# Altium schematic sheet Ada - Base Block - Microcontroller Issue 4.0.SchDoc: Title
size A3; DrawnBy: Name; DocumentNumber: 3; Revision: A; SheetNumber: 3; SheetTotal: 4
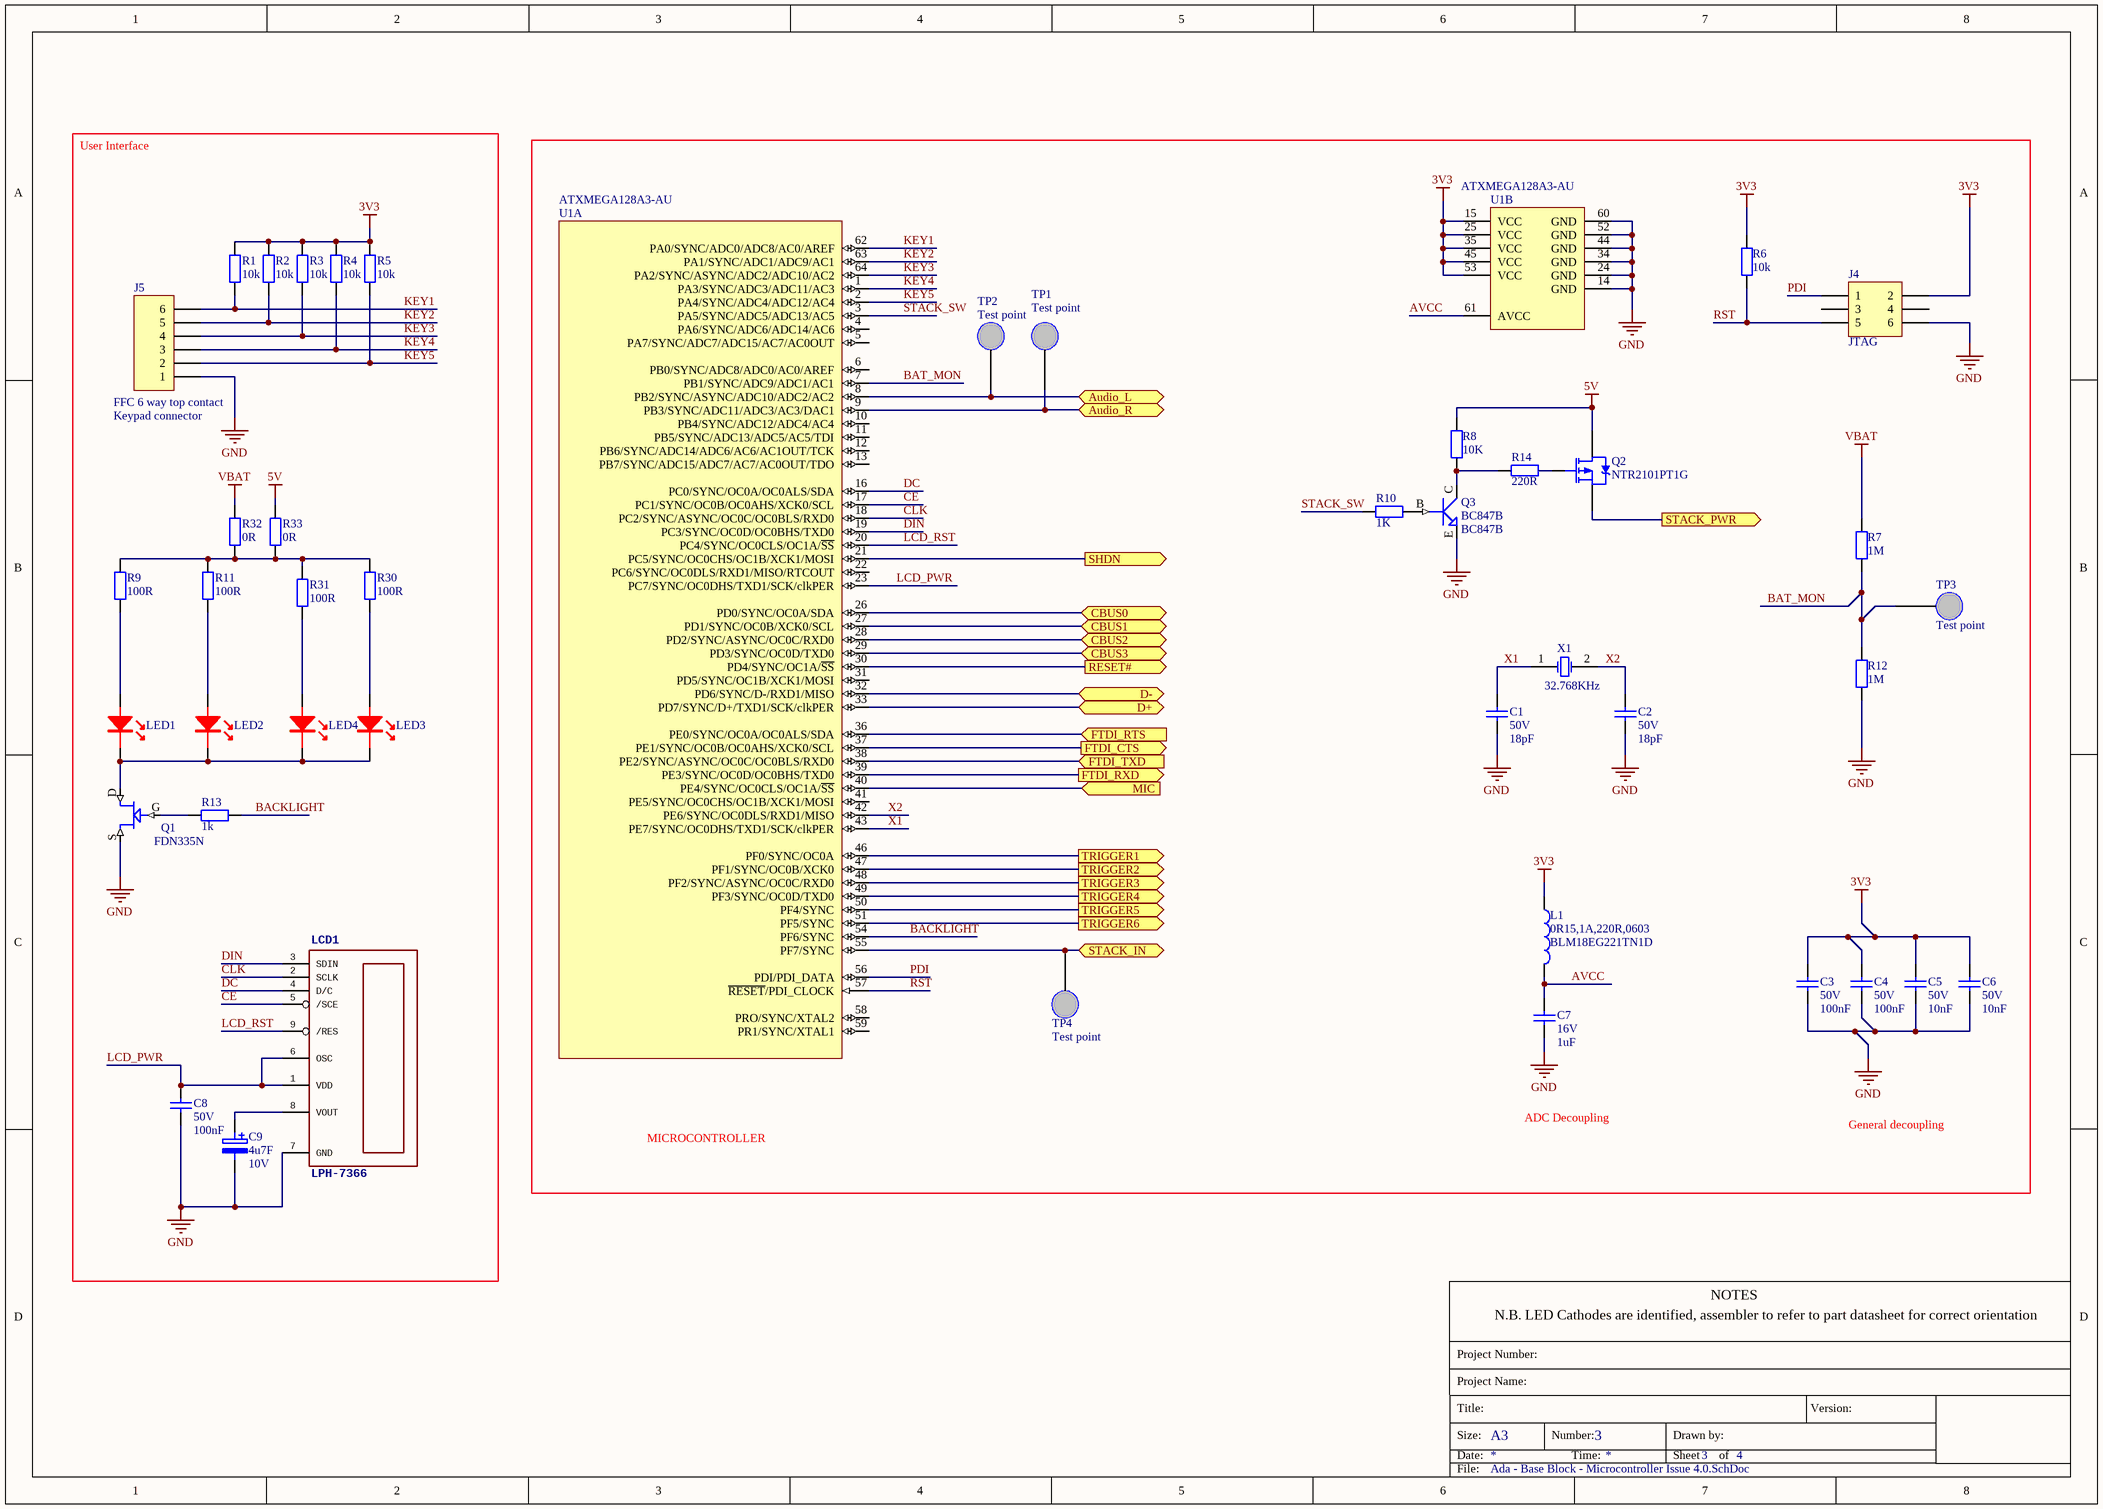
[diagram p0: Ada - Base Block - Microcontroller Issue 4.0.SchDoc]

## Parts
C1  Voltage: 50V  [C0603]  (hidden comment: 18pF)
C2  Voltage: 50V  [C0603]  (hidden comment: 18pF)
C3  value 100nF  Voltage: 50V  [C0603]  (hidden comment: 100nF, 16V, 0603)
C4  value 100nF  Voltage: 50V  [C0603]  (hidden comment: 100nF, 16V, 0603)
C5  Voltage: 50V  [C0603]  (hidden comment: 10nF)
C6  Voltage: 50V  [C0603]  (hidden comment: 10nF)
C7  value 1uF  Voltage: 16V  [C0603]  (hidden comment: 1uF, 16V, 0603)
C8  value 100nF  Voltage: 50V  [C0603]  (hidden comment: 100nF, 16V, 0603)
C9  value 4u7F  Voltage: 10V  [KEMET CASE A]  (hidden comment: 4U7F, 10V, case_a)
J4  JTAG  [HDR2X3]
J5  Keypad connector  value FFC 6 way top contact  [HLW6R-2C7LF]
L1  0R15,1A,220R,0603  value BLM18EG221TN1D  [L0603]
LCD1  LPH-7366  [LPH-7366]
LED1  LED RED 0805 SUPER-RED  [LED, RED, 0805]  (value not drawn)
LED2  LED RED 0805 SUPER-RED  [LED, RED, 0805]  (value not drawn)
LED3  LED RED 0805 SUPER-RED  [LED, RED, 0805]  (value not drawn)
LED4  LED RED 0805 SUPER-RED  [LED, RED, 0805]  (value not drawn)
Q1  FDN335N  [SOT-23]
Q2  NTR2101PT1G  [SOT-23 DIODE - duplicate]
Q3  BC847B  [SOT-23T]
R1  value 10k  [R0603]  (hidden comment: Resistor 0603)
R2  value 10k  [R0603]  (hidden comment: Resistor 0603)
R3  value 10k  [R0603]  (hidden comment: Resistor 0603)
R4  value 10k  [R0603]  (hidden comment: Resistor 0603)
R5  value 10k  [R0603]  (hidden comment: Resistor 0603)
R6  value 10k  [R0603]  (hidden comment: Resistor 0603)
R7  value 1M  [R0603]  (hidden comment: Resistor 0603)
R8  value 10K  [R0603]  (hidden comment: Resistor 0603)
R9  value 100R  [R0603]  (hidden comment: Resistor 0603)
R10  value 1K  [R0603]  (hidden comment: Resistor 0603)
R11  value 100R  [R0603]  (hidden comment: Resistor 0603)
R12  value 1M  [R0603]  (hidden comment: Resistor 0603)
R13  value 1k  [R0603]  (hidden comment: Resistor 0603)
R14  value 220R  [R0603]  (hidden comment: Resistor 0603)
R30  value 100R  [R0603]  (hidden comment: Resistor 0603)
R31  value 100R  [R0603]  (hidden comment: Resistor 0603)
R32  value 0R  [R0603]  (hidden comment: Resistor 0603)
R33  0R  [R0603]
TP1  Test point  [TP]  (no BOM)
TP2  Test point  [TP]  (no BOM)
TP3  Test point  [TP]  (no BOM)
TP4  Test point  [TP]  (no BOM)
U1  ATXMEGA128A3-AU  [64A_N]  (parts A,B of 2)
X1  value 32.768KHz  [FC 13F]  (hidden comment: XTAL 32.768KHZ)

## Blocks framed on the sheet
User Interface: C8 C9 J5 LCD1 LED1-LED4 Q1 R1-R5 R9 R11 R13 R30-R33

## Ports
Audio_L (bidir), Audio_R (bidir), CBUS0 (bidir), CBUS1 (bidir), CBUS2 (bidir), CBUS3 (bidir), D+ (bidir), D- (bidir), FTDI_CTS (out), FTDI_RTS (in), FTDI_RXD (out), FTDI_TXD (in), MIC (in), RESET# (out), SHDN (out), STACK_IN (bidir), STACK_PWR (out), TRIGGER1 (out), TRIGGER2 (out), TRIGGER3 (out), TRIGGER4 (out), TRIGGER5 (out), TRIGGER6 (out)

## Nets
3V3: C3.2 C4.2 C5.2 C6.2 J4.2 L1.1 R1.2 R2.2 R3.2 R4.2 R5.2 R6.2 U1.15(VCC) U1.25(VCC) U1.35(VCC) U1.45(VCC) U1.53(VCC)
5V: Q2.2(S) R8.1 R33.2
GND: C1.1 C2.1 C3.1 C4.1 C5.1 C6.1 C7.1 C8.1 C9.2 J4.6 J5.1 LCD1.7(GND) Q1.S Q3.E(EMITTER) R12.1 U1.14(GND) U1.24(GND) U1.34(GND) U1.44(GND) U1.52(GND) U1.60(GND)
VBAT: R7.2 R32.2
Audio_L: TP2.1 U1.8(PB2/SYNC/ASYNC/ADC10/ADC2/AC2) ; port Audio_L
Audio_R: TP1.1 U1.9(PB3/SYNC/ADC11/ADC3/AC3/DAC1) ; port Audio_R
AVCC: C7.2 L1.2 U1.61(AVCC)
BACKLIGHT: R13.1 U1.54(PF6/SYNC)
BAT_MON: R7.1 R12.2 TP3.1 U1.7(PB1/SYNC/ADC9/ADC1/AC1)
CBUS0: U1.26(PD0/SYNC/OC0A/SDA) ; port CBUS0
CBUS1: U1.27(PD1/SYNC/OC0B/XCK0/SCL) ; port CBUS1
CBUS2: U1.28(PD2/SYNC/ASYNC/OC0C/RXD0) ; port CBUS2
CBUS3: U1.29(PD3/SYNC/OC0D/TXD0) ; port CBUS3
CE: LCD1.5(/SCE) U1.17(PC1/SYNC/OC0B/OC0AHS/XCK0/SCL)
CLK: LCD1.2(SCLK) U1.18(PC2/SYNC/ASYNC/OC0C/OC0BLS/RXD0)
D+: U1.33(PD7/SYNC/D+/TXD1/SCK/clkPER) ; port D+
D-: U1.32(PD6/SYNC/D-/RXD1/MISO) ; port D-
DC: LCD1.4(D/C) U1.16(PC0/SYNC/OC0A/OC0ALS/SDA)
DIN: LCD1.3(SDIN) U1.19(PC3/SYNC/OC0D/OC0BHS/TXD0)
FTDI_CTS: U1.37(PE1/SYNC/OC0B/OC0AHS/XCK0/SCL) ; port FTDI_CTS
FTDI_RTS: U1.36(PE0/SYNC/OC0A/OC0ALS/SDA) ; port FTDI_RTS
FTDI_RXD: U1.39(PE3/SYNC/OC0D/OC0BHS/TXD0) ; port FTDI_RXD
FTDI_TXD: U1.38(PE2/SYNC/ASYNC/OC0C/OC0BLS/RXD0) ; port FTDI_TXD
KEY1: J5.6 R1.1 U1.62(PA0/SYNC/ADC0/ADC8/AC0/AREF)
KEY2: J5.5 R2.1 U1.63(PA1/SYNC/ADC1/ADC9/AC1)
KEY3: J5.4 R3.1 U1.64(PA2/SYNC/ASYNC/ADC2/ADC10/AC2)
KEY4: J5.3 R4.1 U1.1(PA3/SYNC/ADC3/ADC11/AC3)
KEY5: J5.2 R5.1 U1.2(PA4/SYNC/ADC4/ADC12/AC4)
LCD_PWR: C8.2 LCD1.1(VDD) LCD1.6(OSC) U1.23(PC7/SYNC/OC0DHS/TXD1/SCK/clkPER)
LCD_RST: LCD1.9(/RES) U1.20(PC4/SYNC/OC0CLS/OC1A/~{SS})
MIC: U1.40(PE4/SYNC/OC0CLS/OC1A/~{SS}) ; port MIC
PDI: J4.1 U1.56(PDI/PDI_DATA)
RESET#: U1.30(PD4/SYNC/OC1A/~{SS}) ; port RESET#
RST: J4.5 R6.1 U1.57(~{RESET}/PDI_CLOCK)
SHDN: U1.21(PC5/SYNC/OC0CHS/OC1B/XCK1/MOSI) ; port SHDN
STACK_IN: TP4.1 U1.55(PF7/SYNC) ; port STACK_IN
STACK_PWR: Q2.3(D) ; port STACK_PWR
STACK_SW: R10.1 U1.3(PA5/SYNC/ADC5/ADC13/AC5)
TRIGGER1: U1.46(PF0/SYNC/OC0A) ; port TRIGGER1
TRIGGER2: U1.47(PF1/SYNC/OC0B/XCK0) ; port TRIGGER2
TRIGGER3: U1.48(PF2/SYNC/ASYNC/OC0C/RXD0) ; port TRIGGER3
TRIGGER4: U1.49(PF3/SYNC/OC0D/TXD0) ; port TRIGGER4
TRIGGER5: U1.50(PF4/SYNC) ; port TRIGGER5
TRIGGER6: U1.51(PF5/SYNC) ; port TRIGGER6
X1: C1.2 U1.43(PE7/SYNC/OC0DHS/TXD1/SCK/clkPER) X1.1(OSC1)
X2: C2.2 U1.42(PE6/SYNC/OC0DLS/RXD1/MISO) X1.2(OSC2)
NetC9_1: C9.1 LCD1.8(VOUT)
NetLED1_A: LED1.A R9.1
NetLED1_K: LED1.K LED2.K LED3.K LED4.K Q1.D
NetLED2_A: LED2.A R11.1
NetLED3_A: LED3.A R30.1
NetLED4_A: LED4.A R31.1
NetQ1_G: Q1.G R13.2
NetQ2_1: Q2.1(G) R14.2
NetQ3_B: Q3.B(BASE) R10.2
NetQ3_C: Q3.C(COLLECTOR) R8.2 R14.1
NetR9_2: R9.2 R11.2 R30.2 R31.2 R32.1 R33.1

Not connected (* = marked no-connect by the designer): J4 3 4; U1 4(PA6/SYNC/ADC6/ADC14/AC6) 5(PA7/SYNC/ADC7/ADC15/AC7/AC0OUT) 6(PB0/SYNC/ADC8/ADC0/AC0/AREF) 10(PB4/SYNC/ADC12/ADC4/AC4) 11(PB5/SYNC/ADC13/ADC5/AC5/TDI) 12(PB6/SYNC/ADC14/ADC6/AC6/AC1OUT/TCK) 13(PB7/SYNC/ADC15/ADC7/AC7/AC0OUT/TDO) 22(PC6/SYNC/OC0DLS/RXD1/MISO/RTCOUT) 31(PD5/SYNC/OC1B/XCK1/MOSI) 41(PE5/SYNC/OC0CHS/OC1B/XCK1/MOSI) 58(PRO/SYNC/XTAL2) 59(PR1/SYNC/XTAL1)

## Notes on the sheet
- ADC Decoupling
- General decoupling
- MICROCONTROLLER
- N.B. LED Cathodes are identified, assembler to refer to part datasheet for correct orientation
- NOTES
- Project Name:
- Project Number:
- Title:
- Size:
- Date:
- A3
- Number:
- Time:
- Sheet
- Drawn by:
- of
- Version:
- File:

## Library data of the parts
C1 C2 = 18pF, 50V, 0603: Ceramic; Manufacturer: KEMET; Manuf Part #: C0603C180J5GAC; FEC#: 1414620; Part No.: 1414620; Supplier: FEC; Value: 18pF
C3 C4 C8 = 100nF, 16V, 0603: Ceramic; Manufacturer: TruCap; Manuf Part #: U0603R103; Part No.: 71-1964; Supplier: Rapid
C5 C6 = 10nF, 50V, 0603: Ceramic; Manufacturer: MULTICOMP; Manuf Part #: MCCA000238; Part No.: 71-1964; FEC#: 1759104; Supplier: Rapid; Value: 10nF
C7 = 1uF, 16V, 0603: Ceramic; Manufacturer: KEMET; Manuf Part #: C0603C105K4PAC; FEC#: 1288256; Part No.: 1288256; Supplier: FEC
C9 = 4U7F, 10V, case_a: Tantalum; Manufacturer: KEMET; Manuf Part #: T491A475K010AT; FEC#: 1457427; Part No.: 1457427; Supplier: FEC
J4 = Header 2x3: Header, 15-Pin, Dual row; Manufacturer: TruConnect; Part No.: 22-0500; Value: JTAG Header; Supplier: Rapid
J5 = Header 6: Header, 6-Pin; Manufacturer: FCI; Part No.: 649-HLW6R-2C7LF; Manuf Part #: HLW6R-2C7LF; Supplier: MOUSER
L1 = 0R15,1A,220R,0603: FERRITE BEAD; Manufacturer: MURATA; FEC#: 1515717; RS#: 724-1328; Current: 1A; Manuf Part #: BLM18EG221TN1D; Part No.: 1515717; Supplier: FEC
LCD1 = LPH-7366: Manufacturer: Na; Part No.: LPH7366-1; Value: LPH7366-1; Manuf Part #: na; Supplier: www.008620.net
LED1-LED4 = LED RED 0805 SUPER-RED: LED, SMD, 0805, SUPER-RED; Manufacturer: MULTICOMP; Manuf Part #: MCL-S270SRC; FEC#: 1581239; Value: MCL-S270SRC; Part No.: 1581239; Supplier: FEC; Supplier 1: Farnell; Supplier Part Number 1: 1581239
Q1 = FDN335N: Manufacturer: FAIRCHILD SEMICONDUCTOR; FEC#: 9845348RL; Manuf Part #: FDN335N; Part No.: 9845348RL; Supplier: FEC; Value: FDN335N
Q2 = PMOS-2: P-Channel Power MOSFET; Manufacturer: ON SEMICONDUCTOR; Current: 3.7A; FEC#: 1431297; Voltage: 8V; Manuf Part #: NTR2101PT1G; Part No.: NTR2101PT1G; Supplier: FEC
R33 = Resistor 0603: Value: 0R
U1 = ATxmega256A3U-AU: 8/16-bit AVR XMEGA A4 Microcontroller, 1.6-3.6V, 32MHz, 256K + 8KB Flash, 4K EEPROM, 16K SRAM, 64-pin TQFP, Industrial Grade (-40°C to 85°C); Manufacturer: ATMEL; FEC#: 1748550; Manuf Part #: ATXMEGA128A3-AU; Part No.: 1748550; Supplier: FEC; Value: ATXMEGA128A3-AU
X1 = XTAL 32.768KHZ: Crystal Oscillator, 32.768KHZ; Manufacturer: EPSON TOYOCOM; Manuf Part #: FC-13F,32.768KHZ, 12.5PF; FEC#: 1712821; Part No.: 1712821; Supplier: FEC
Q3 = BC847B: Value: BC847B